# EAGLE schematic RJ45 Breakout (EAGLE 9.4.2)
RJ45 Breakout to Data + Power
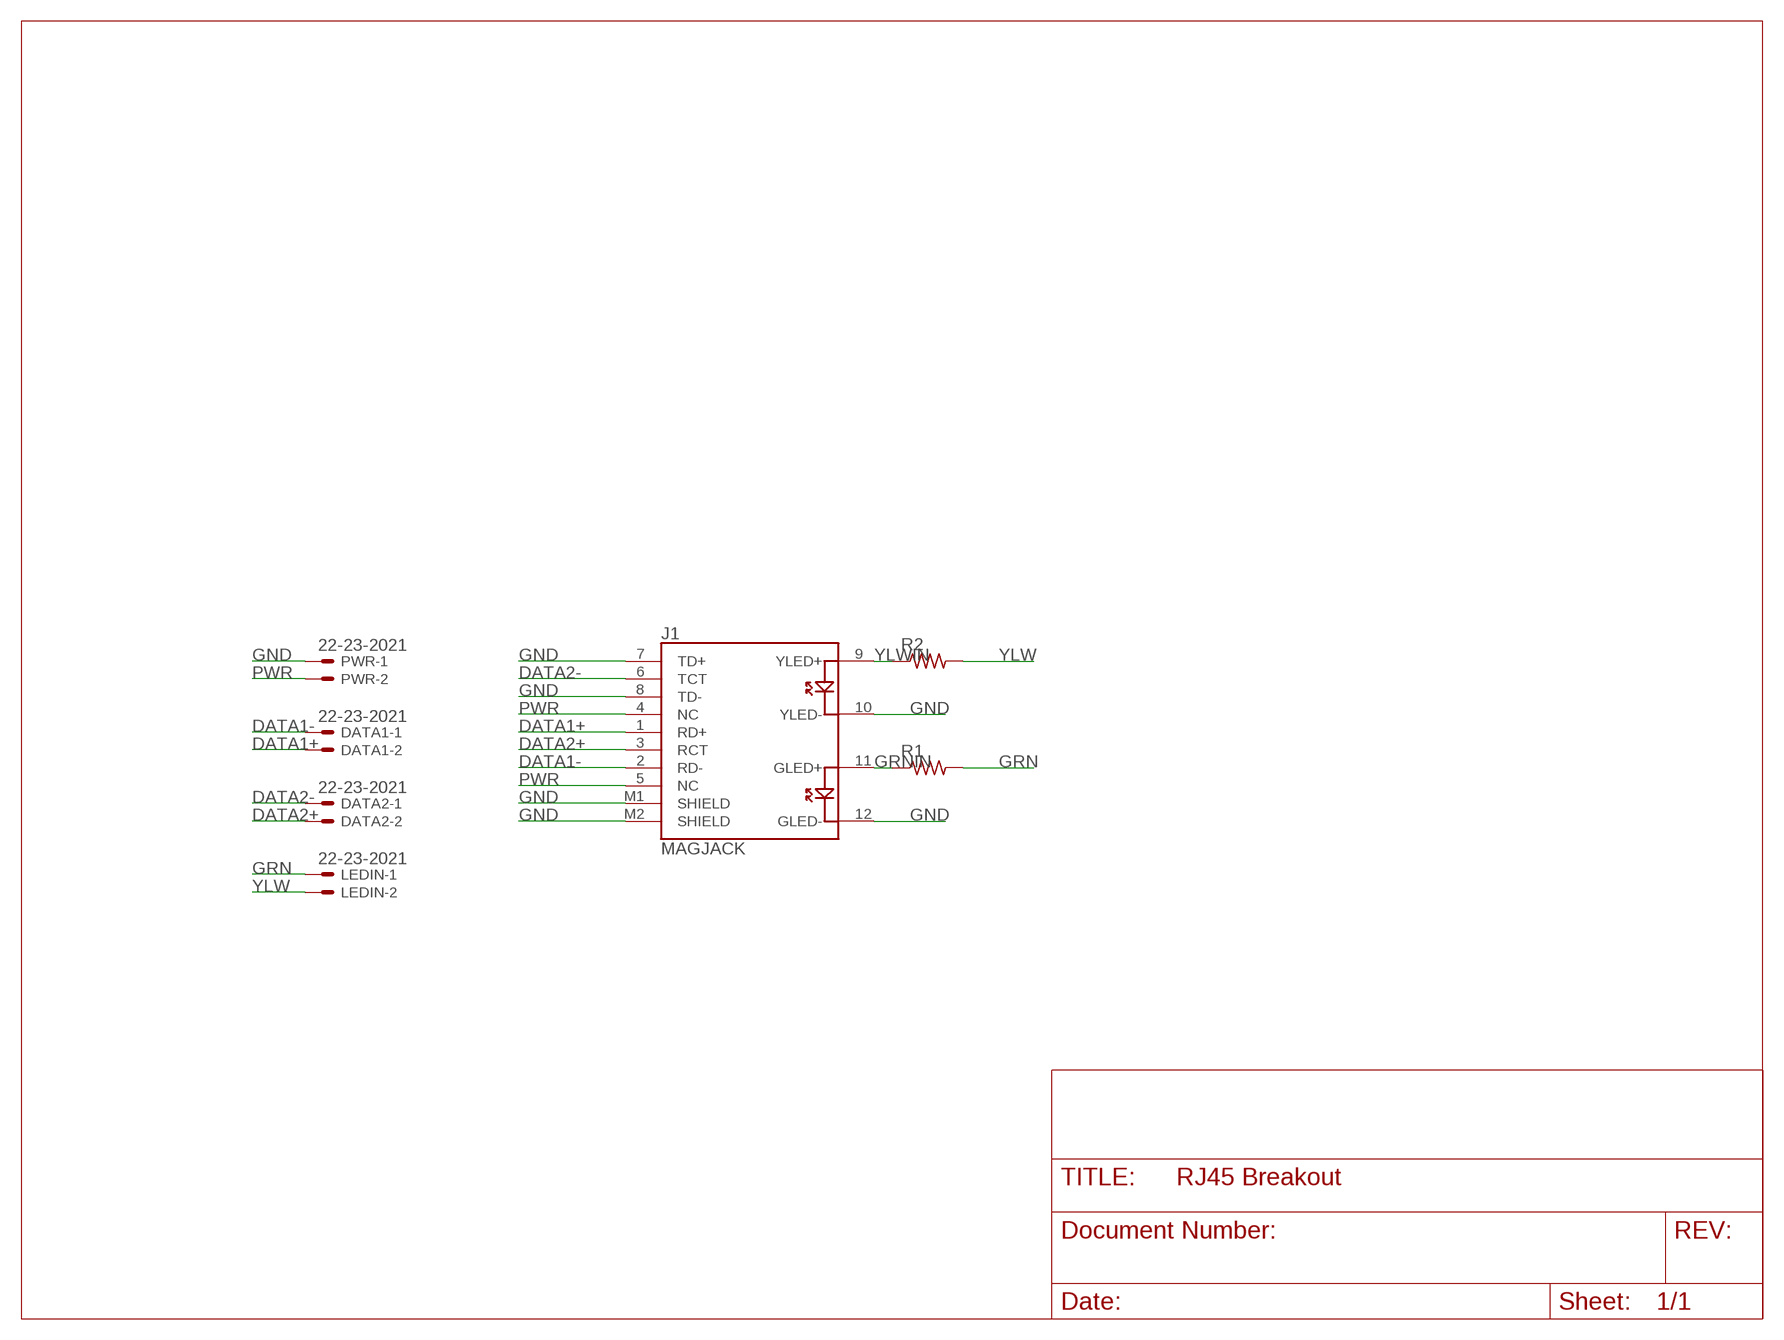
[diagram p0: schematic, sheet 1]

## Parts
DATA1  22-23-2021  [22-23-2021]
DATA2  22-23-2021  [22-23-2021]
J1  MAGJACK  [MAGJACK]
LEDIN  22-23-2021  [22-23-2021]
PWR  22-23-2021  [22-23-2021]
R1  R-US_0207/10  [0207/10]
R2  R-US_0207/10  [0207/10]

## Nets
DATA1+: DATA1.2 J1.1(RD+)
DATA1-: DATA1.1 J1.2(RD-)
DATA2+: DATA2.2 J1.3(RCT)
DATA2-: DATA2.1 J1.6(TCT)
GND: J1.7(TD+) J1.8(TD-) J1.10(YLED-) J1.12(GLED-) J1.M1(SHIELD) J1.M2(SHIELD) PWR.1
GRN: LEDIN.1 R1.2
GRNIN: J1.11(GLED+) R1.1
PWR: J1.4(NC) J1.5(NC) PWR.2
YLW: LEDIN.2 R2.2
YLWIN: J1.9(YLED+) R2.1

## Library data of the parts
DATA1 DATA2 LEDIN PWR = con-molex:22-23-2021: .100" (2.54mm) Center Header - 2 Pin; MF: MOLEX; MPN: 22-23-2021; OC_FARNELL: 1462926; OC_NEWARK: 25C3832
J1 = SparkFun-Connectors:MAGJACK: MAGJACK: RJ-45 with LEDs This is a single port, RJ45 ethernet jacks with built in transformer (magnetics), status LEDs, and shielding. Here is the connector we sell at SparkFun: RJ45 Ethernet MagJack-Compatible <https://www.sparkfun.com/products/8534> (PRT-08534) Datasheet <http://www.sparkfun.com/datasheets/Prototyping/MagJack.pdf> It is used on this SparkFun product: SparkFun RJ45 MagJack Breakout <https://www.sparkfun.com/products/13021> (BOB-13021); PROD_ID: CONN-09556; SF_ID: PRT-08534
R1 R2 = rcl:R-US_: RESISTOR, American symbol; SPICEPREFIX: R